# Altium schematic sheet PCB_Project_Board_2.SchDoc
size A; SheetNumber: 1; SheetTotal: 1
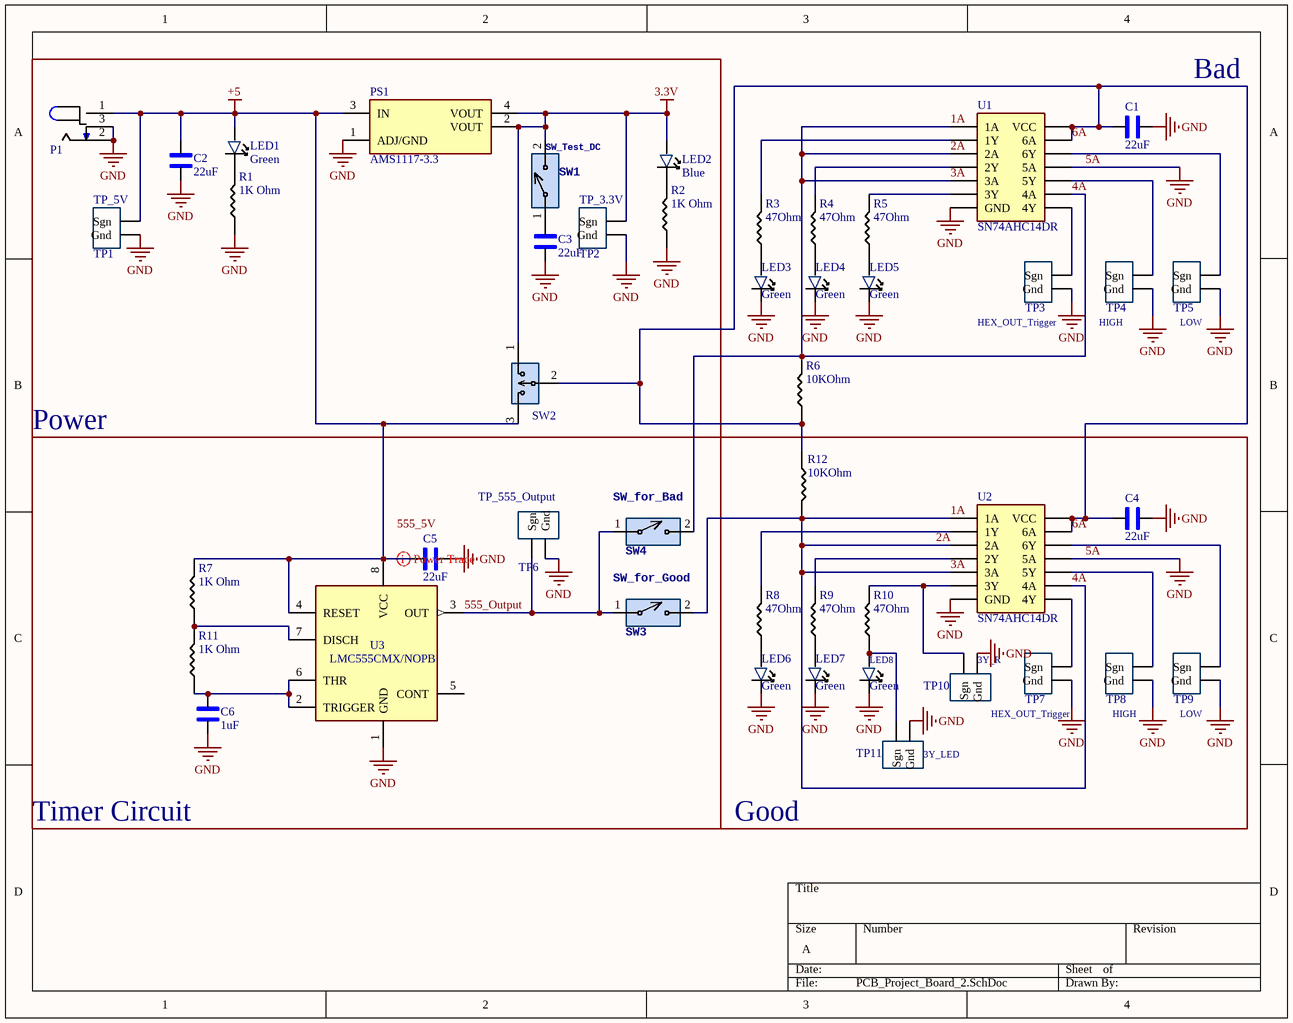
[diagram p0: PCB_Project_Board_2.SchDoc]

## Parts
C1  22uF  [1206_Passive_Capacitor]
C2  22uF  [1206_Passive_Capacitor]
C3  22uF  [1206_Passive_Capacitor]
C4  22uF  [1206_Passive_Capacitor]
C5  22uF  [1206_Passive_Capacitor]
C6  1uF  [1206_Passive_Capacitor]
LED1  Green  [LED_1206]
LED2  Blue  [LED_1206]
LED3  Green  [LED_1206]
LED4  Green  [LED_1206]
LED5  Green  [LED_1206]
LED6  Green  [LED_1206]
LED7  Green  [LED_1206]
LED8  Green  [LED_1206]
P1  Power Jack  [Power_Jack]  (value not drawn)
PS1  AMS1117-3.3  [LDO]
R1  value 1K Ohm  [1206_Passive_Resitor]  (hidden comment: 1k)
R2  value 1K Ohm  [1206_Passive_Resitor]  (hidden comment: 1k)
R3  value 47Ohm  [1206_Passive_Resitor]  (hidden comment: 47 Ohms)
R4  value 47Ohm  [1206_Passive_Resitor]  (hidden comment: 47 Ohms)
R5  value 47Ohm  [1206_Passive_Resitor]  (hidden comment: 47 Ohms)
R6  value 10KOhm  [1206_Passive_Resitor]  (hidden comment: 10k)
R7  value 1K Ohm  [1206_Passive_Resitor]  (hidden comment: 1k)
R8  value 47Ohm  [1206_Passive_Resitor]  (hidden comment: 47 Ohms)
R9  value 47Ohm  [1206_Passive_Resitor]  (hidden comment: 47 Ohms)
R10  value 47Ohm  [1206_Passive_Resitor]  (hidden comment: 47 Ohms)
R11  value 1K Ohm  [1206_Passive_Resitor]  (hidden comment: 1k)
R12  value 10KOhm  [1206_Passive_Resitor]  (hidden comment: 10k)
SW1  SW_Test_DC  [2Pin-Header-Conn]
SW2  PREC003SAAN-RC  [3_PIN_100mil]  (value not drawn)
SW3  SW_for_Good  [2Pin-Header-Conn]
SW4  SW_for_Bad  [2Pin-Header-Conn]
TP1  TP_5V  [TP10x_Probe]
TP2  TP_3.3V  [TP10x_Probe]
TP3  HEX_OUT_Trigger  [TP10x_Probe]
TP4  HIGH  [TP10x_Probe]
TP5  LOW  [TP10x_Probe]
TP6  TP_555_Output  [TP10x_Probe]
TP7  HEX_OUT_Trigger  [TP10x_Probe]
TP8  HIGH  [TP10x_Probe]
TP9  LOW  [TP10x_Probe]
TP10  3Y_R  [TP10x_Probe]
TP11  3Y_LED  [TP10x_Probe]
U1  SN74AHC14DR  [HEX_74AC14]
U2  SN74AHC14DR  [HEX_74AC14]
U3  LMC555CMX/NOPB  [TS555IDTTR]

## Blocks framed on the sheet
Power: C2 C3 LED1 LED2 P1 PS1 R1 R2 SW1 SW2 TP1 TP2
Timer Circuit: C5 C6 R7 R11 SW3 SW4 TP6 U3
Good: C4 LED6-LED8 R8-R10 R12 TP7-TP11 U2

## Nets
3.3V: LED2.1 PS1.2(VOUT) PS1.4(VOUT) SW1.2 SW2.1 TP2.1(Sgn)
5A: C1.2 C2.1 C3.1 C4.2 C5.1 C6.1 LED3.2 LED4.2 LED5.2 LED6.2 LED7.2 LED8.2 P1.2 P1.3 PS1.1(ADJ/GND) R1.1 R2.1 TP1.2(Gnd) TP2.2(Gnd) TP3.2(Gnd) TP4.2(Gnd) TP5.2(Gnd) TP6.2(Gnd) TP7.2(Gnd) TP8.2(Gnd) TP9.2(Gnd) TP10.2(Gnd) TP11.2(Gnd) U1.7(GND) U1.11(5A) U2.7(GND) U2.11(5A) U3.1(GND)  [also labelled GND]
+5: C2.2 C5.2 LED1.1 P1.1 PS1.3(IN) R7.2 SW2.3 TP1.1(Sgn) U3.4(RESET) U3.8(VCC)
1A: R6.2 R12.2 SW3.2 SW4.2 U1.1(1A) U1.3(2A) U1.5(3A) U1.9(4A) U2.1(1A) U2.3(2A) U2.5(3A) U2.9(4A)  [also labelled 2A, 3A, 4A]
6A: C1.1 C4.1 R6.1 R12.1 SW2.2 U1.13(6A) U1.14(VCC) U2.13(6A) U2.14(VCC)
555_Output: SW3.1 SW4.1 TP6.1(Sgn) U3.3(OUT)
NetC3_2: C3.2 SW1.1
NetC6_2: C6.2 R11.1 U3.2(TRIGGER) U3.6(THR)
NetLED1_2: LED1.2 R1.2
NetLED2_2: LED2.2 R2.2
NetLED3_1: LED3.1 R3.1
NetLED4_1: LED4.1 R4.1
NetLED5_1: LED5.1 R5.1
NetLED6_1: LED6.1 R8.1
NetLED7_1: LED7.1 R9.1
NetLED8_1: LED8.1 R10.1 TP11.1(Sgn)
NetR3_2: R3.2 U1.2(1Y)
NetR4_2: R4.2 U1.4(2Y)
NetR5_2: R5.2 U1.6(3Y)
NetR7_1: R7.1 R11.2 U3.7(DISCH)
NetR8_2: R8.2 U2.2(1Y)
NetR9_2: R9.2 U2.4(2Y)
NetR10_2: R10.2 TP10.1(Sgn) U2.6(3Y)
NetTP3_1: TP3.1(Sgn) U1.8(4Y)
NetTP4_1: TP4.1(Sgn) U1.10(5Y)
NetTP5_1: TP5.1(Sgn) U1.12(6Y)
NetTP7_1: TP7.1(Sgn) U2.8(4Y)
NetTP8_1: TP8.1(Sgn) U2.10(5Y)
NetTP9_1: TP9.1(Sgn) U2.12(6Y)

Not connected (* = marked no-connect by the designer): U3 5(CONT)

## Layout directives
rule Width Constraint [Pref Width = 20mil    Min Width = 10mil    Max Width = 100mil]: +5

## Notes on the sheet
- Bad
- Labels drawn without touching a wire or pin: 555_5V

## Library data of the parts
C1-C5 = C_22uF_1206: 22uF ±10% 25V X5R 1206 Multilayer Ceramic Capacitors MLCC - SMD/SMT RoHS; MFR Part #: CL31A226KAHNNNE; Type: basic; LCSC Part#: C12891; Datasheet: https://datasheet.lcsc.com/lcsc/1811031514_Samsung-Electro-Mechanics-CL31A226KAHNNNE_C12891.pdf; Value: 22uF
C6 = C_1uF_1206: MULTILAYER CERAMIC CAPACITORS MLCC - SMD/SMT 1UF 50V 1206 ROHS; MFR Part #: CL31B105KBHNNNE; Type: Basic; Digikey Link: https://www.digikey.com/product-detail/en/C1206C105M4RACTU/399-8150-1-ND/3471873/?itemSeq=304982366; LCSC Part#: C1848; Value: 1uF
LED1 LED3-LED8 = LED_GREEN_1206: Green 513~528nm 1206 Light Emitting Diodes (LED) RoHS; MFR Part #: SZYY1206G; Type: Extended; LCSC Part#: C434439; Datasheet: https://datasheet.lcsc.com/lcsc/2006301532_Yongyu-Photoelectric-SZYY1206G_C434439.pdf; Value: Green
LED2 = LED_BLUE_1206: blue 1206  Light Emitting Diodes (LED) ROHS; MFR Part #: NCD1206B1; Type: Extended; LCSC Part#: C130717; Datasheet: https://datasheet.lcsc.com/lcsc/2008201033_Foshan-NationStar-Optoelectronics-NCD1206B1_C130717.pdf; Value: Blue
P1 = P_Power Jack: Power Barrel Connector Jack 2.10mm ID (0.083"), 5.50mm OD (0.217") Through Hole, Right Angle; MFR Part #: PJ-102A; Value: CONN PWR JACK 2X5.5MM SOLDER; Digikey Link: https://www.digikey.com/product-detail/en/PJ-102A/CP-102A-ND/275425/?itemSeq=304982367; LCSC Part#: C136744; Type: Extended
PS1 = PS_AMS_LDO_3v3: LOW DROPOUT REGULATORS(LDO) POSITIVE FIXED 1.3V @ 800MA 15V 3.3V 1A SOT-223 ROHS; Value: IC REG LINEAR 3.3V 800MA SOT223; MFR Part #: AMS1117-3.3; LCSC Part#: C6186; Type: Basic
R1 R2 R7 R11 = R_1K_1206: CHIP RESISTOR - SURFACE MOUNT 1KOHMS ±1% 1/4W 1206 ROHS; MFR Part #: RNCP1206FTD1K00CT; Digikey Link: https://www.digikey.com/product-detail/en/RNCP1206FTD1K00/RNCP1206FTD1K00CT-ND/2240675/?itemSeq=304982373; LCSC Part#: C4410; Type: Basic
R3-R5 R8-R10 = R_47Ohm_1206: 47Ω ±5% 0.25W ±200ppm/℃ 1206 Chip Resistor - Surface Mount RoHS; MFR Part #: 1206W4J0470T5E; LCSC Part#: C25384; Type: Extended; Datasheet: https://datasheet.lcsc.com/lcsc/1811101020_UNI-ROYAL-Uniroyal-Elec-1206W4J0470T5E_C25384.pdf
R6 R12 = R_10KOhm_1206: 10 kOhms ±5% 0.25W, 1/4W Chip Resistor 1206 (3216 Metric) Automotive AEC-Q200 Thick Film; MFR Part #: RMCF1206FT10K0; Digikey Link: https://www.digikey.com/en/products/detail/stackpole-electronics-inc/RMCF1206FT10K0/1759669; LCSC Part#: C17902; Type: Basic
SW1 SW3 SW4 = SW_2Pin_100mil_Switch: 2Pin Header; LCSC Part#: C124375; Type: Extended
SW2 = SW_3Pin_100mil_Switch: Connector Header Through Hole 3 position 0.100" (2.54mm); Value: CONN HEADER VERT 3POS 2.54MM; Digikey Link: https://www.digikey.com/product-detail/en/PREC003SAAN-RC/S1012EC-03-ND/2774851/?itemSeq=304982371; MFR Part #: PREC003SAAN-RC; Type: Extended; LCSC Part#: C49257
TP1-TP11 = TP_10x_Probe: Test Point 300 mil centers
U1 U2 = U_74_AHC_Hex: Inverter IC 6 Channel Schmitt Trigger 14-SOIC; Datasheet: https://datasheet.lcsc.com/szlcsc/ON-Semicon-ON-74AC14SCX_C5482.pdf; MFR Part #: SN74AHC14DR; LCSC Part#: C6942; Type: Extended
U3 = U_555_Fast: 555 Type, Timer/Oscillator _Single_ IC 3MHz 8-SO; Package: SOIC-8; MFR Part #: LMC555CMX/NOPB; DigiKey link: https://www.digikey.com/product-detail/en/texas-instruments/LMC555CMX-NOPB/LMC555CMX-NOPBCT-ND/1010550; LCSC Part#: C90760; Type: Extended